# Altium schematic sheet MSP430.SchDoc: 电容 ----功能电路图
size OrCAD C; Author: 于晓飞
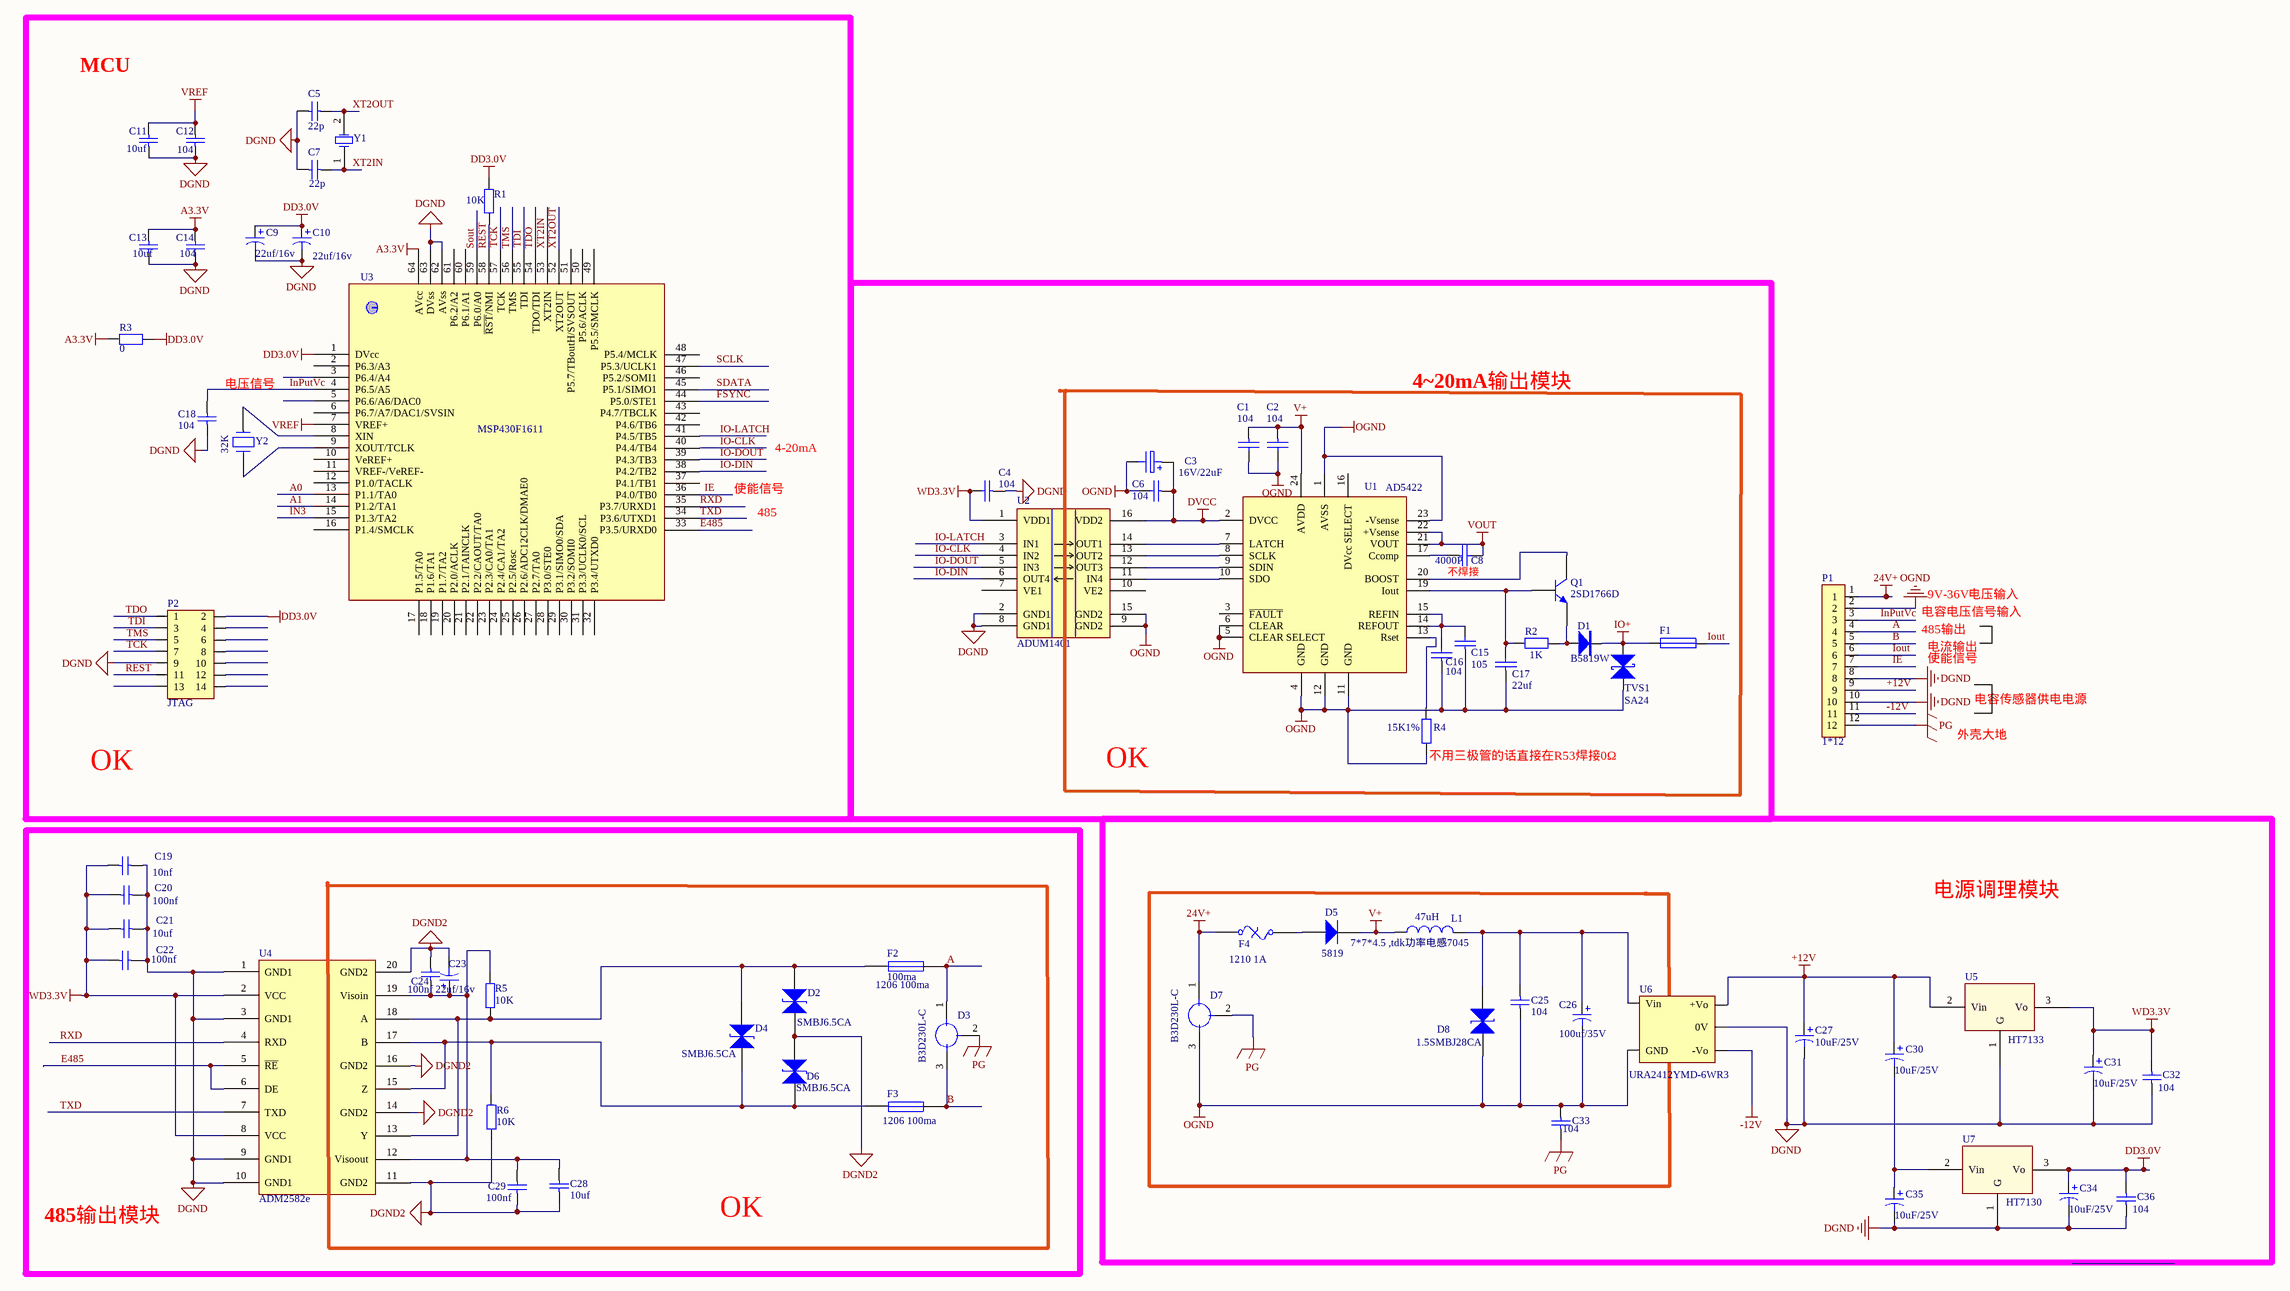
[diagram p0: MSP430.SchDoc]

## Parts
C1  104  [0805]
C2  104  [0805]
C3  16V/22uF  [3216]
C4  104  [0805]
C5  22p  [0805]
C6  104  [0805]
C7  22p  [0805]
C8  4000P  [0805]
C9  22uf/16v  [B型 3528]
C10  22uf/16v  [B型 3528]
C11  10uf  [0805]
C12  104  [0805]
C13  10uf  [0805]
C14  104  [0805]
C15  105  [0805]
C16  104  [0805]
C17  22uf  [0805]
C18  104  [0805]
C19  10nf  [0805]
C20  100nf  [0805]
C21  10uf  [0805]
C22  100nf  [0805]
C23  22uf/16v  [B型 3528]
C24  100nf  [0805]
C25  104  [0805]
C26  value 100uf/35V  [C5X5]  (hidden comment: 10uf/35V)
C27  10uF/25V  [3216]
C28  10uf  [0805]
C29  100nf  [0805]
C30  value 10uF/25V  [3216]  (hidden comment: 10uF)
C31  value 10uF/25V  [3216]  (hidden comment: 10uF)
C32  104  [0805]
C33  104  [1812]
C34  value 10uF/25V  [3216]  (hidden comment: 10uF)
C35  value 10uF/25V  [3216]  (hidden comment: 10uF)
C36  104  [0805]
D1  B5819W  [7227-D]
D2  SMBJ6.5CA  [7227-D]
D3  B3D230L-C  [B3D090L-C]
D4  SMBJ6.5CA  [7227-D]
D5  5819  [7227-D]
D6  SMBJ6.5CA  [7227-D]
D7  B3D230L-C  [B3D090L-C]
D8  1.5SMBJ28CA  [7227-D]
F1  (no value)  [1206]
F2  100ma  [1206R]
F3  100ma  [1206R]  (value not drawn)
F4  Fuse Thermal  200ma  [1210]  (value not drawn)
L1  value 47uH  [L7X7]  (hidden comment: 100uH)
P1  1*12
P2  JTAG  [14缺口]
Q1  2SD1766D  [SOT-89-2]
R1  10K  [0805]
R2  1K  [0805]
R3  0  [0805]
R4  15K1%  [0805]
R5  10K  [0805]
R6  10K  [0805]
TVS1  SA24  [7227-D]
U1  AD5422  [AD5422]
U2  ADUM1401  [SO16W]
U3  MSP430F1611  [PM]
U4  ADM2582e  [AM258XXX]
U5  HT7133  [SOT-89-2]
U6  URA2412YMD-6WR3
U7  HT7130  [SOT-89-2]
Y1  8M  [5032]  (value not drawn)
Y2  32K  [FC-135]

## Blocks framed on the sheet
OK: C5 C7 C9-C14 C18 P2 R1 R3 U3 Y1 Y2
OK: C1-C4 C6 C8 C15-C17 D1 F1 Q1 R2 R4 TVS1 U1 U2
485输出模块: C19-C22 U4
电源调理模块: C25-C27 C30-C36 D5 D7 D8 F4 L1 U5-U7
OK: C23 C24 C28 C29 D2-D4 D6 F2 F3 R5 R6

## Nets
24V+: D7.1 F4.1 P1.1
+12V: C27.1 C30.1 P1.9 U5.2(Vin)
-12V: P1.11 U6.4(-Vo)
A3.3V: C13.1 C14.1 R3.1 U3.64(AVcc)
DD3.0V: C9.1 C10.1 C34.1 C36.2 P2.2 R1.2 R3.2 U3.1(DVcc) U7.3(Vo)
DGND: C4.1 C5.2 C7.2 C9.2 C10.2 C11.2 C12.2 C13.2 C14.2 C18.1 C19.1 C20.1 C21.1 C22.1 C27.2 C31.2 C32.1 C34.2 C35.2 C36.1 P1.8 P1.10 P2.9 U2.2(GND1) U2.8(GND1) U3.62(AVss) U3.63(DVss) U4.1(GND1) U4.3(GND1) U4.9(GND1) U4.10(GND1) U5.1(G) U6.4(0V) U7.1(G)
DGND2: C23.2 C24.1 C28.2 C29.2 D2.1(K) D6.1(K) R6.2 U4.11(GND2) U4.14(GND2) U4.16(GND2) U4.20(GND2)
DVCC: C3.1 C6.1 U1.2(DVCC) U2.16(VDD2)
IO+: D1.2(K) F1.2 TVS1.2(K)
OGND: C1.2 C2.2 C3.2 C6.2 C15.1 C16.1 C17.1 C25.1 C26.2 C33.2 D7.3 D8.1(K) P1.2 R4.2 TVS1.1(A) U1.1(AVSS) U1.4(GND) U1.5(CLEAR_SELECT) U1.6(CLEAR) U1.11(GND) U1.12(GND) U1.23(-Vsense) U2.9(GND2) U2.15(GND2) U6.1(GND)
PG: C33.1 D3.2 D7.2 P1.12
V+: C1.1 C2.1 D5.2(K) L1.1 U1.24(AVDD)
VOUT: C8.2 U1.21(VOUT) U1.22(+Vsense)
VREF: C11.1 C12.1 U3.7(VREF+)
WD3.3V: C4.2 C19.2 C20.2 C21.2 C22.2 C31.1 C32.2 U2.1(VDD1) U4.2(VCC) U4.8(VCC) U5.3(Vo)
A: D3.1 F2.2 P1.4
A0: U3.13(P1.1/TA0)
A1: U3.14(P1.2/TA1)
B: D3.3 F3.2 P1.5
E485: U3.33(P3.5/URXD0) U4.5(~{RE}) U4.6(DE)
FSYNC: U3.44(P5.0/STE1)
IE: P1.7 U3.36(P4.0/TB0)
IN3: U3.15(P1.3/TA2)
InPutVc: C18.2 P1.3 U3.4(P6.5/A5)
IO-CLK: U2.4(IN2) U3.40(P4.4/TB4)
IO-DIN: U2.6(OUT4) U3.38(P4.2/TB2)
IO-DOUT: U2.5(IN3) U3.39(P4.3/TB3)
IO-LATCH: U2.3(IN1) U3.41(P4.5/TB5)
Iout: F1.1 P1.6
REST: P2.11 R1.1 U3.58(~{RST}/NMI)
RXD: U3.35(P3.7/URXD1) U4.4(RXD)
SCLK: U3.47(P5.3/UCLK1)
SDATA: U3.45(P5.1/SIMO1)
Sout: U3.59(P6.0/A0)
TCK: P2.7 U3.57(TCK)
TDI: P2.3 U3.55(TDI)
TDO: P2.1 U3.54(TDO/TDI)
TMS: P2.5 U3.56(TMS)
TXD: U3.34(P3.6/UTXD1) U4.7(TXD)
XT2IN: C7.1 U3.53(XT2IN) Y1.1(OSC1)
XT2OUT: C5.1 U3.52(XT2OUT) Y1.2(OSC2)
NetC8_1: C8.1 U1.17(Ccomp)
NetC15_2: C15.2 C16.2 U1.14(REFOUT) U1.15(REFIN)
NetC17_2: C17.2 Q1.1(B) R2.2 U1.19(Iout)
NetC23_1: C23.1 C24.2 C28.1 C29.1 R5.1 U4.12(Visoout) U4.19(Visoin)
NetC25_2: C25.2 C26.1 D8.2(A) L1.2 U6.2(Vin)
NetC30_2: C30.2 C35.1 U7.2(Vin)
NetD1_1: D1.1(A) Q1.3(E) R2.1
NetD2_2: D2.2(A) D4.2(A) F2.1 R5.2 U4.13(Y) U4.18(A)
NetD4_1: D4.1(K) D6.2(A) F3.1 R6.1 U4.15(Z) U4.17(B)
NetD5_1: D5.1(A) F4.2
NetQ1_2: Q1.2(C) U1.20(BOOST)
NetR4_1: R4.1 U1.13(Rset)
NetU1_7: U1.7(LATCH) U2.14(OUT1)
NetU1_8: U1.8(SCLK) U2.13(OUT2)
NetU1_9: U1.9(SDIN) U2.12(OUT3)
NetU1_10: U1.10(SDO) U2.11(IN4)
NetU3_8: U3.8(XIN) Y2.1
NetU3_9: U3.9(XOUT/TCLK) Y2.2

Not connected (* = marked no-connect by the designer): P2 4 6 8 10 12 13 14; U1 3(~{FAULT}) 16(DVcc_SELECT); U2 7(VE1) 10(VE2); U3 2(P6.3/A3) 3(P6.4/A4) 5(P6.6/A6/DAC0) 6(P6.7/A7/DAC1/SVSIN) 10(VeREF+) 11(VREF-/VeREF-) 12(P1.0/TACLK) 16(P1.4/SMCLK) 17(P1.5/TA0) 18(P1.6/TA1) 19(P1.7/TA2) 20(P2.0/ACLK) 21(P2.1/TAINCLK) 22(P2.2/CAOUT/TA0) 23(P2.3/CA0/TA1) 24(P2.4/CA1/TA2) 25(P2.5/Rosc) 26(P2.6/ADC12CLK/DMAE0) 27(P2.7/TA0) 28(P3.0/STE0) 29(P3.1/SIMO0/SDA) 30(P3.2/SOMI0) 31(P3.3/UCLK0/SCL) 32(P3.4/UTXD0) 37(P4.1/TB1) 42(P4.6/TB6) 43(P4.7/TBCLK) 46(P5.2/SOMI1) 48(P5.4/MCLK) 49(P5.5/SMCLK) 50(P5.6/ACLK) 51(P5.7/TBoutH/SVSOUT) 60(P6.1/A1) 61(P6.2/A2); U6 3(+Vo)

## Notes on the sheet
- MCU
- 电压信号
- 4~20mA输出模块
- 使能信号
- 4-20mA
- 485
- (near C8) 不焊接
- 电容电压信号输入
- 9V-36V电压输入
- 485输出
- 电流输出
- 电容传感器供电电源
- (near R4) 不用三极管的话直接在R53焊接0Ω
- 外壳大地
- 1210 1A
- (near L1) 7*7*4.5 ,tdk功率电感7045
- (near F2) 1206 100ma
- (near F3) 1206 100ma

## Library data of the parts
C1 C2 C4 C6 C8 C15-C17 = CAP
C3 = ELECTRO1
C5 C7 C11-C14 C32 C36 = Cap: Capacitor; Published: 8-Jun-2000; LatestRevisionDate: 17-Jul-2002; LatestRevisionNote: Re-released for DXP Platform.; PackageReference: RAD-0.3; Publisher: Altium Limited
  C5 C7: Value: 22p
  C11 C13: Value: 10uf
  C12 C14 C32 C36: Value: 104
C9 C10 C23 = Cap Pol2_B
C18-C22 C24 C25 C28 C29 C33 = Cap_1: Capacitor; Published: 8-Jun-2000; LatestRevisionDate: 17-Jul-2002; LatestRevisionNote: Re-released for DXP Platform.; PackageReference: RAD-0.3; Publisher: Altium Limited
  C18 C25 C33: Value: 104
C26 = Cap Pol2: Polarized Capacitor (Axial); Published: 8-Jun-2000; LatestRevisionDate: 17-Jul-2002; LatestRevisionNote: Re-released for DXP Platform.; PackageReference: POLAR0.8; Publisher: Altium Limited
C27 = Cap Pol1: Polarized Capacitor (Radial); Value: 10uF/16V; Published: 8-Jun-2000; LatestRevisionDate: 17-Jul-2002; LatestRevisionNote: Re-released for DXP Platform.; PackageReference: RB7.6-15; Publisher: Altium Limited
C30 C31 C34 C35 = Cap Pol1: Polarized Capacitor (Radial); Published: 8-Jun-2000; LatestRevisionDate: 17-Jul-2002; LatestRevisionNote: Re-released for DXP Platform.; PackageReference: RB7.6-15; Publisher: Altium Limited
D1 = B5819W: Diode
D2 D4 D6 D8 TVS1 = TVS
D5 = Diode: Default Diode; Published: 8-Jun-2000; LatestRevisionDate: 17-Jul-2002; LatestRevisionNote: Re-released for DXP Platform.; PackageDocument: Sep-1996; PackageReference: SMC; Publisher: Altium Limited; Code_JEDEC: DO-214-AB
F1 = FUSE1: Fuse
F2 F3 = Fuse 1: Fuse; Published: 8-Jun-2000; LatestRevisionDate: 17-Jul-2002; LatestRevisionNote: Re-released for DXP Platform.; PackageReference: PIN-W2/E2.8; Publisher: Altium Limited
F4 = Fuse Thermal: Thermal Fuse; Published: 24-Mar-1999; LatestRevisionDate: 17-Jul-2002; LatestRevisionNote: Re-released for DXP Platform.; PackageReference: PIN-W2/E2.8; Publisher: Altium Limited
L1 = Inductor: Code_IEC: 1005; Published: 8-Jun-2000; LatestRevisionDate: 17-Jul-2002; LatestRevisionNote: Re-released for DXP Platform.; PackageReference: 0402-A; Publisher: Altium Limited; Code_JEITA: 0402
P2 = 2*7
Q1 = NPN: NPN General Purpose Amplifier; Published: 8-Jun-2000; LatestRevisionDate: 15-Jan-2003; LatestRevisionNote: PCB Footprint 'BCY-W3/D4.7' replaced; DatasheetVersion: 1997; PackageVersion: Sep-1998; PackageReference: TO-92A; Publisher: Altium Limited; PackageDescription: TO, Flat Index; 3 In-Line, Axial Leads; Body Dia. 4.5mm; Leads 0.51 x 0.48 mm (max); ComponentLink1Description: Manufacturer Link; ComponentLink1URL: http://www.fairchildsemi.com/; ComponentLink2Description: Datasheet; ComponentLink2URL: http://www.fairchildsemi.com/ds/2N%2F2N3904.pdf
R1-R6 = Res2: Resistor; Published: 8-Jun-2000; LatestRevisionDate: 17-Jul-2002; LatestRevisionNote: Re-released for DXP Platform.; PackageReference: AXIAL-0.4; Publisher: Altium Limited
  R1 R5 R6: Value: 10K
  R2: Value: 1K
  R3: Value: 0
  R4: Value: 15K1%
U3 = MSP430F1611IPM
U4 = ADM258XXX
U5 U7 = HT7150-1
U6 = URB2409YMD-6WR3_1 双路
Y1 = XTAL: Crystal Oscillator; Published: 8-Jun-2000; LatestRevisionDate: 17-Jul-2002; LatestRevisionNote: Re-released for DXP Platform.; PackageReference: R38; Publisher: Altium Limited
Y2 = CRYSTAL